# EAGLE design 3PDT_Breakout (EAGLE 9.6.2)
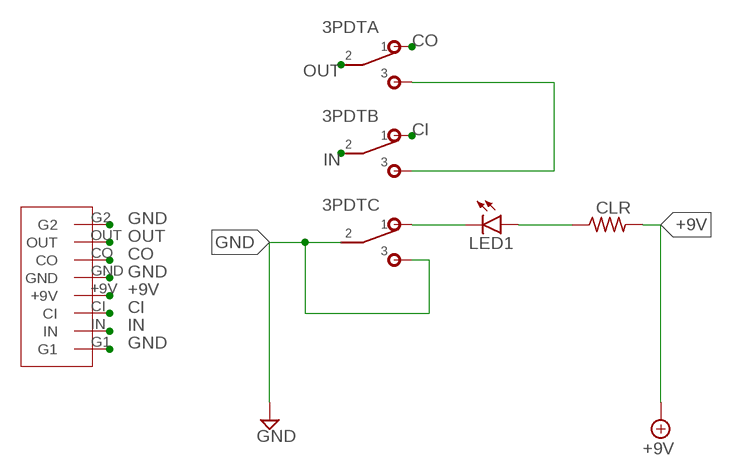
[diagram p0: schematic, sheet 1]

## Parts
3PDT  3PDT  [3PDT]
CLR  RESISTORS.3B  [R0207/3]
LED1  LED3MM  [LED3MM]
U$1  HEADERS8  [HEADERS8]

## Nets
+9V: CLR.2 U$1.+9V
CI: 3PDT.B1 U$1.CI
CO: 3PDT.A1 U$1.CO
GND: 3PDT.C2 3PDT.C3 U$1.G1 U$1.G2 U$1.GND
IN: 3PDT.B2 U$1.IN
N$1: 3PDT.C1 LED1.K(C)
N$2: CLR.1 LED1.A
N$5: 3PDT.A3 3PDT.B3
OUT: 3PDT.A2 U$1.OUT

## Library data of the parts
3PDT = switches:3PDT: Mountain Switch 108-1M31T1B1M1QE-EVX https://www.mouser.com/ProductDetail/Mountain-Switch/108-1M31T1B1M1QE-EVX?qs=sGAEpiMZZMvudeGI7i40XO%252BnGhp8Hy%252BJe46O%2FBjy5XE%3D
CLR = resistors:RESISTORS
LED1 = diodes:LED
U$1 = my_headers:HEADERS8

## Board
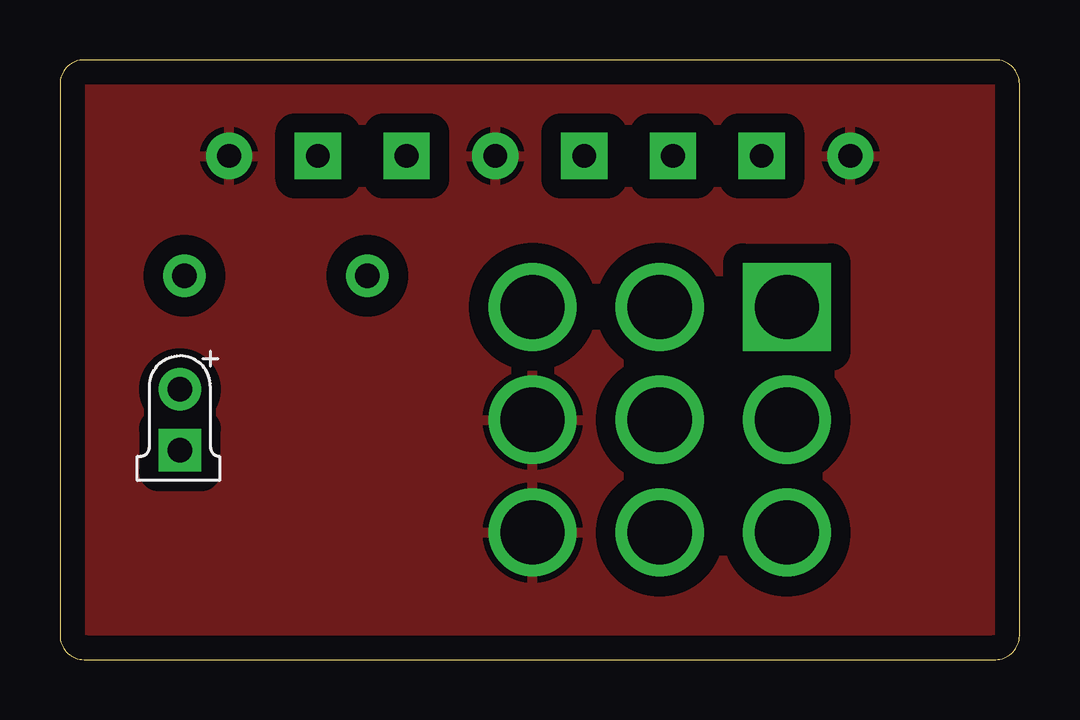
[diagram p1: board, top side]
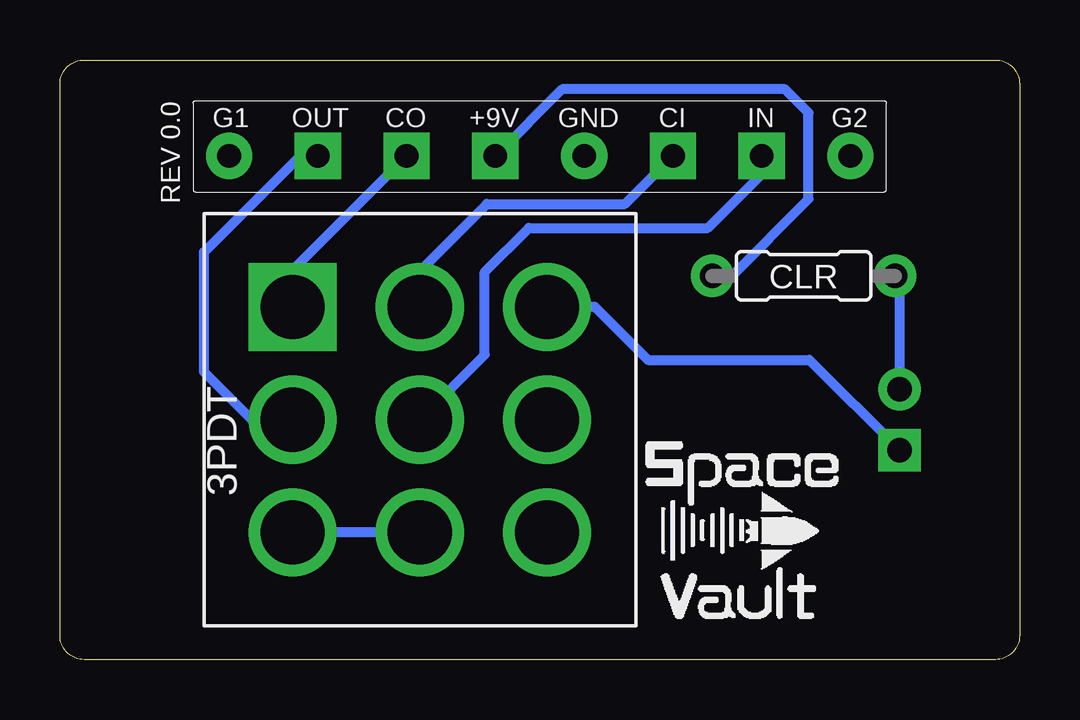
[diagram p2: board, bottom side, seen from below]

Size 40 x 25 mm. Coordinates in mm from the lower left corner, seen from the top.
Outline: 0,24 0,1 arc90 1,0 39,0 arc90 40,1 40,24 arc90 39,25 1,25 arc90 0,24
Copper layers (1*16): Top 0.035mm / dielectric 1.5mm / Bottom 0.035mm
Design rules "default *": minimum track width 6mil, minimum drill 0.35mm, track to track 6mil, track to pad 10mil, pad to pad 6mil, via to via 6mil, smd to smd 6mil, copper to edge 40mil, drill to drill 6mil, minimum pad ring 10mil, minimum via ring 8mil, stop-mask expansion 4mil, vias tented up to drill 0mil, thermal gap 10mil

### Footprints (pad centres in the part's own frame; a part is rotated, then mirrored left to right if it is on the bottom)
3PDT = drill 2.667 square: A1 -5.3,4.7 | drill 2.667: A2 -5.3,0; A3 -5.3,-4.7; B1 0,4.7; B2 0,0; B3 0,-4.7; C1 5.3,4.7; C2 5.3,0; C3 5.3,-4.7
R0207/3 = drill 1.016 pad 1.778: 1 -3.81,0; 2 3.81,0
LED3MM = drill 1.016 pad 1.778: A -1.27,0 | drill 1.016 pad 1.778 square: K 1.27,0
HEADERS8 = drill 0.991 pad 1.93 square: +9V -1.85,0; CI 5.55,0; CO -5.55,0; IN 9.25,0; OUT -9.25,0 | drill 0.991 pad 1.93: G1 -12.95,0; G2 12.95,0; GND 1.85,0

### Placement (x,y rotation side)
3PDT  25,10 0 bottom
CLR  9,16 180 bottom
LED1  5,10 270 top
U$1  20,21 0 bottom

### Tracks (layer width: path | path; a pad name or v marks a point on that pad's centre or on a via)
+9V
  Bottom 0.406: CLR.2 12,16 8.8,19.2 8.8,22.8 9.78,23.78 19.07,23.78 U$1.+9V
CI
  Bottom 0.406: 3PDT.B1 25,16.2 22.2,19 16.45,19 U$1.CI
CO
  Bottom 0.406: 3PDT.A1 30.3,16.25 U$1.CO
GND
  pour Top (isolate 0.813): 0,17 0,24 arc-90 1,25 5,25 39,25 arc-90 40,24 40,17 40,1 arc-90 39,0 20,0 1,0 arc-90 0,1
IN
  Bottom 0.406: 3PDT.B2 22.3,12.7 22.3,16.15 20.45,18 13,18 10.75,20.25 U$1.IN
N$1
  Bottom 0.406: LED1.K 8.77,12.5 15.5,12.5 17.7,14.7 3PDT.C1
N$2
  Bottom 0.406: LED1.A 5,15.81 CLR.1
N$5
  Bottom 0.406: 3PDT.B3 3PDT.A3
OUT
  Bottom 0.406: 3PDT.A2 32,10 34,12 34,17 30,21 U$1.OUT

### Text on the board
bPlace: REV 0.0